# EasyEDA Pro project MAX5864_REUSE.eprj, board PCB7
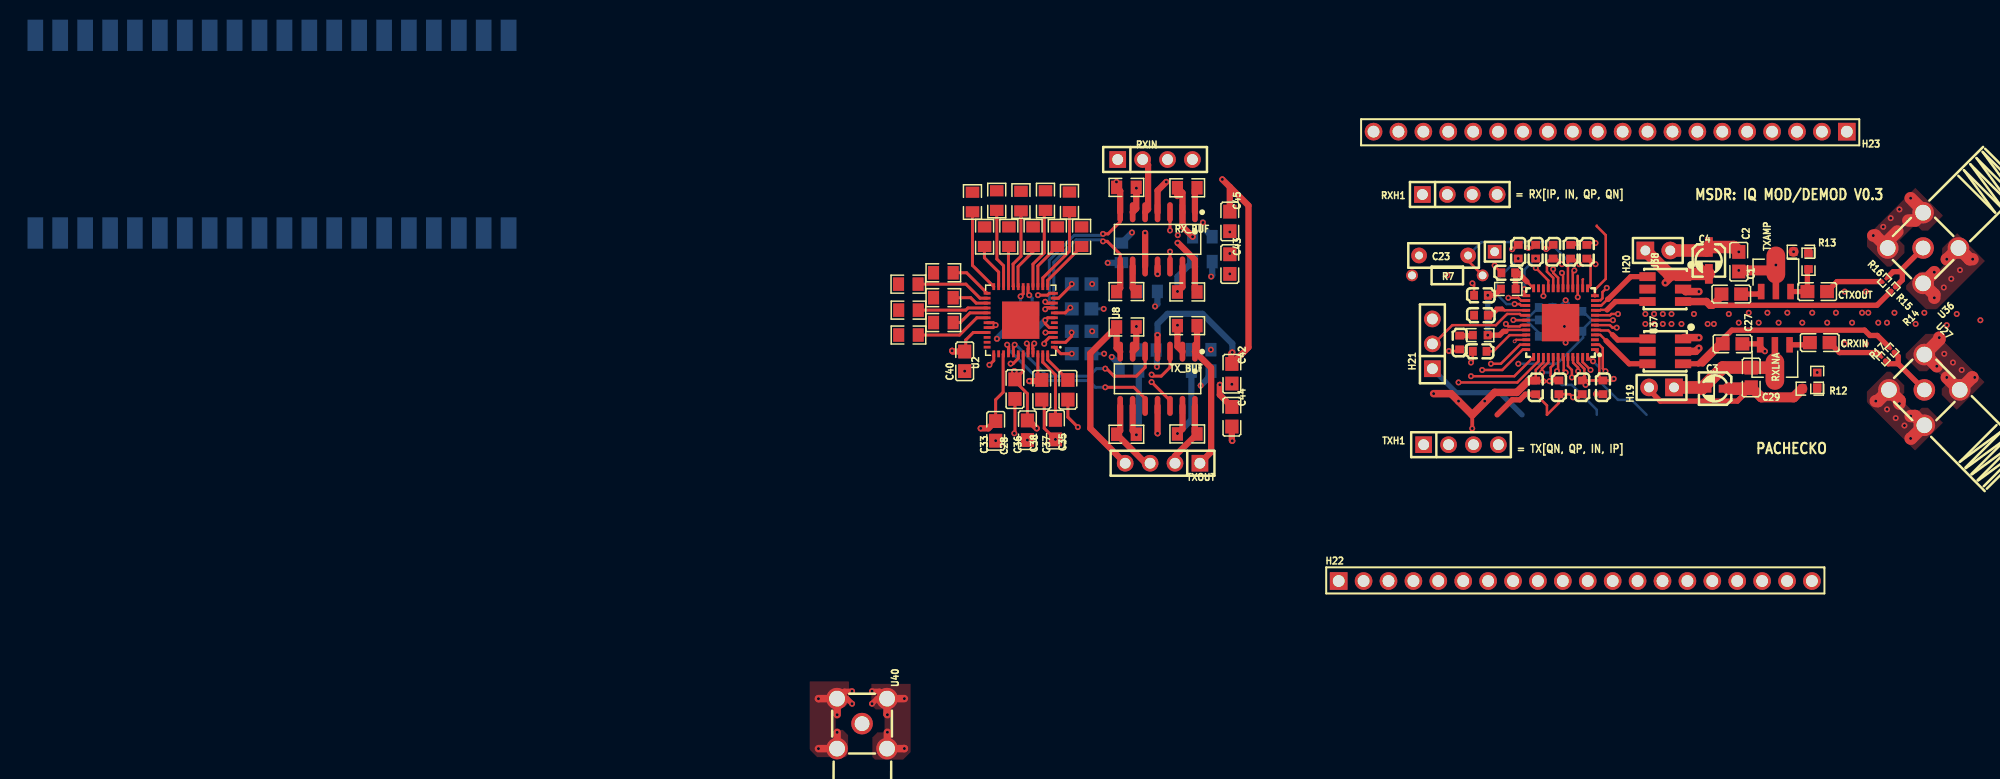
[diagram p14: board, top side]
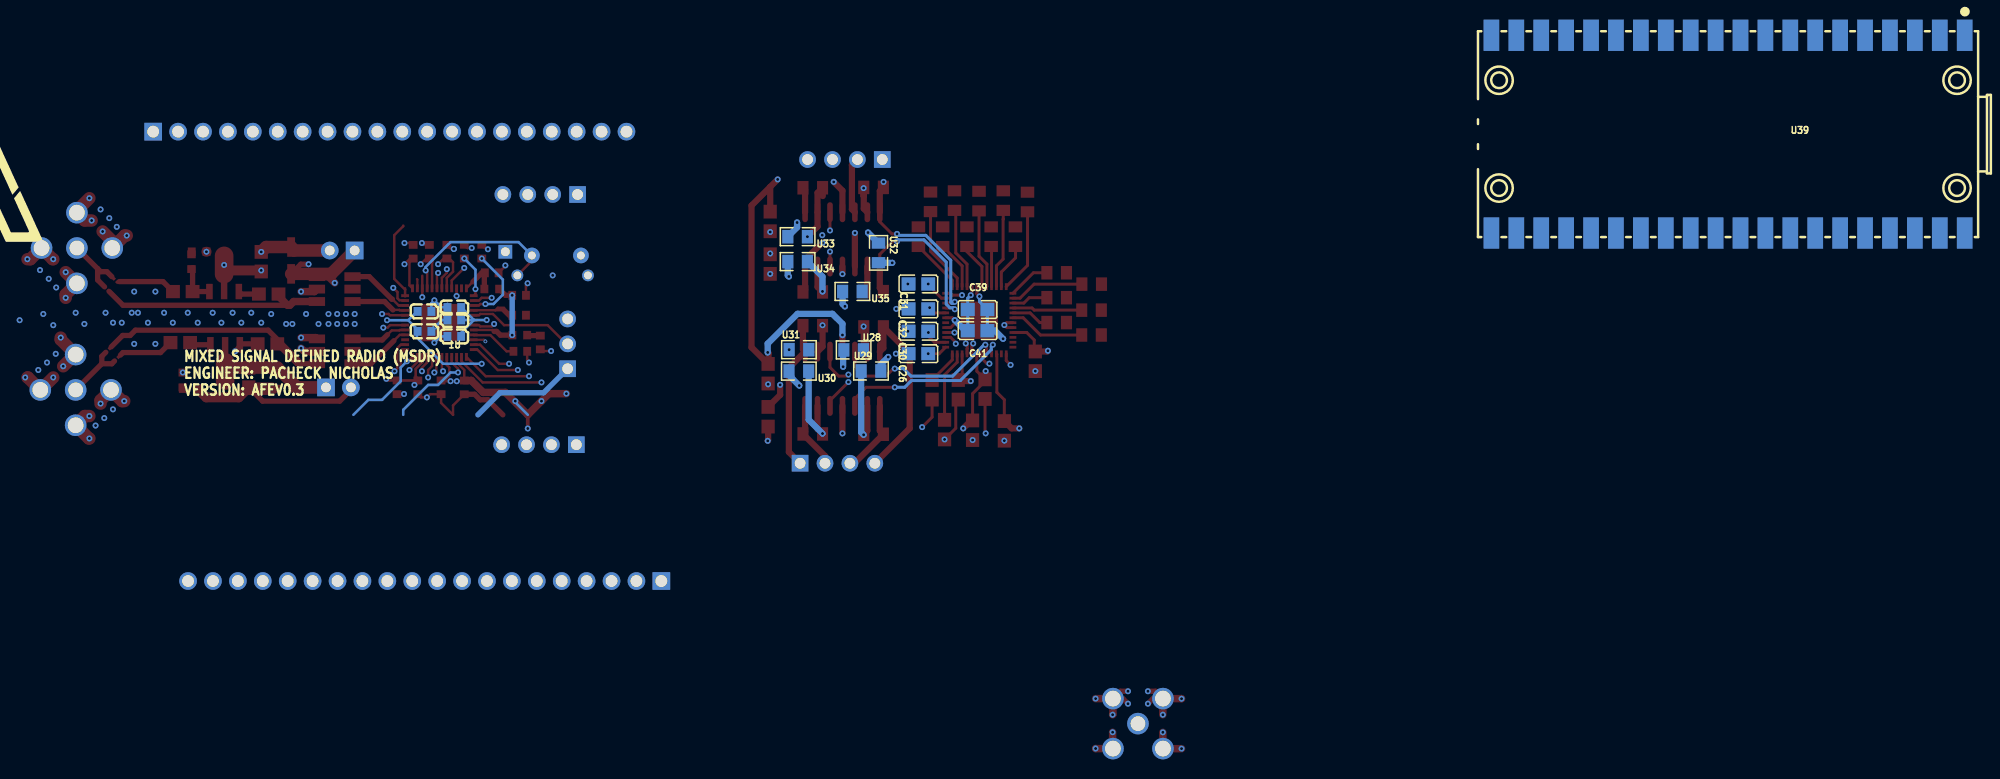
[diagram p15: board, bottom side, seen from below]

No outline. copper layers: Top Layer, Inner1, Inner2, Inner3, Inner4, Bottom Layer. Coordinates in mm from the lowest, leftmost part position.
Stack: Top Layer 0.035mm 外层铜厚1oz / Dielectric1 0.0994mm 3313 RC57% 4.2mil / Inner1 0.0152mm 内层铜厚 / Dielectric2 0.55mm 0.55mm H/H不含铜 / Inner2 0.0152mm 内层铜厚 / Dielectric3 0.1088mm 2116 RC54% 4.9mil / Inner3 0.0152mm 内层铜厚 / Dielectric4 0.55mm 0.55mm H/H不含铜 / Inner4 0.0152mm 内层铜厚 / Dielectric5 0.0994mm 3313 RC57% 4.2mil / Bottom Layer 0.035mm 外层铜厚1oz

## Design rules (mm)
template: JLCPCB Capability(Two Layers Board)
spacing copperThickness1oz (default): track to track 0.102, other pairs 0.152 to 0.3
spacing copperThickness2oz: track to track 0.203, other pairs 0.152 to 0.3
track width copperThickness1oz (default): min 0.127, default 0.254, max 2.54
track width copperThickness2oz: min 0.203, default 0.254, max 2.54
differential pair differentialPair (default): width min 0.127, default 0.254, max 2.54; gap min 0.152, default 0.152
via viaSize (default): diameter min 0.5, default 0.61, max 10; hole min 0.3, default 0.305, max 6.3

## Placement (name value [footprint] x y rotation side)
C1  22nF  [C0805]  148.49 43.83 0 top
C2  100nF  [C0805]  149.26 47.13 270 top
C3  100uF  [CAP-SMD_BD3.0-L3.3-W3.3-RD]  146.84 34.17 0 top
C4  100uF  [CAP-SMD_BD3.0-L3.3-W3.3-RD]  146.21 47.26 90 top
C18  100nF  [C0603]  122.84 37.98 0 top
C19  100nF  [C0603]  122.96 41.67 0 top
C20  100pF  [C0603]  125.75 45.99 0 top
C21  2200pF  [C0603]  120.8 38.89 90 top
C22  68pF  [C0603]  122.96 43.7 0 top
C23  470nF  [CAP-TH_L7.2-W2.5-P5.00-D0.5]  119.16 47.76 0 top
C26  330nF  [C0805]  82.24 37.74 180 bottom
C27  22nF  [C0805]  148.62 38.75 0 top
C28  100nF  [C0805]  75.45 34.12 90 top
C29  100nF  [C0805]  150.53 35.32 90 top
C30  100nF  [C0805]  82.24 40.03 0 bottom
C31  100nF  [C0805]  82.24 44.86 180 bottom
C32  100nF  [C0805]  82.24 42.31 180 bottom
C33  100nF  [C0805]  73.48 29.87 270 top
C35  330nF  [C0805]  80.85 34.06 270 top
C36  100nF  [C0805]  76.72 29.93 90 top
C37  330nF  [C0805]  79.58 30 90 top
C38  100nF  [C0805]  78.18 34.06 90 top
C39  100nF  [C0805]  76.21 42.25 180 bottom
C40  100nF  [C0805]  70.32 36.97 90 top
C41  100nF  [C0805]  76.21 40.09 180 bottom
C42  330nF  [C0805]  97.57 35.7 90 top
C43  330nF  [C0805]  97.36 46.89 270 top
C44  330nF  [C0805]  97.57 31.31 270 top
C45  330nF  [C0805]  97.36 51.24 90 top
CLNA  100pF  [C0603]  135.4 34.31 270 top
CPA  100nF  [C0603]  133.76 48.14 90 top
CPA1  10uF  [C0603]  132.61 42.06 180 bottom
CPA2  10uF  [C0603]  132.61 40.03 180 bottom
CPLL  100pF  [C0603]  130.32 48.15 90 top
CRXIN  22nF  [C0805]  157.51 38.87 0 top
CRXMX  100pF  [C0603]  133.29 34.31 270 top
CTXMX  100pF  [C0603]  132.11 48.14 90 top
CTXOUT  22nF  [C0805]  157.26 44.08 0 top
CVCCCP  10nF  [C0603]  128.55 48.15 90 top
CVCO0  100pF  [C0603]  129.57 42.45 0 bottom
CVCO1  100pF  [C0603]  129.57 41.18 0 bottom
CVCO2  100pF  [C0603]  129.57 39.51 0 bottom
CVRXA  100pF  [C0603]  128.56 34.3 270 top
CVRXF  100pF  [C0603]  130.92 34.31 270 top
CVXTAL  100pF  [C0603]  126.77 48.15 90 top
H12  -  [HDR-TH_1P-V-M_XKB_X4611WV-01I-C28D40]  124.36 48.14 180 top
H19  -  [HDR-TH_2P-P2.54-V-M-1]  141.38 34.3 180 top
H20  -  [HDR-TH_2P-P2.54-V-M-1]  141 48.27 0 top
H21  -  [HDR-TH_3P-P2.54-V-M]  118.01 38.75 90 top
H22  -  [HDR-TH_20P-P2.54-V-M-1]  132.59 14.55 0 top
H23  -  [HDR-TH_20P-P2.54-V-M-1]  136.14 60.4 180 top
R5  1.2k  [R0603]  122.89 39.64 0 top
R6  750  [R0603]  125.75 44.34 180 top
R7  10kΩ  [RES-TH_BD1.8-L3.2-P7.20-D0.4]  119.54 45.73 0 top
R10  10K  [R0603]  157.26 35.06 270 top
R11  10K  [R0603]  156.37 47.13 90 top
R12  150 @ 12v  [R0603]  156.5 34.17 180 top
R13  150 @ 12v  [R0603]  155.59 48.14 180 top
R14  10K  [R0201]  164.88 38.11 135 top
R15  10K  [R0201]  165 44.33 225 top
R16  10K  [R0201]  164.12 45.22 225 top
R17  10K  [R0201]  163.99 37.22 135 top
RX_BUF  CLC4601ISO14X  [SOIC-14_L8.7-W3.9-P1.27-LS6.0-BL]  89.99 49.41 180 top
RXH1  -  [HDR-TH_4P-P2.54-V-M]  120.81 53.99 0 top
RXIN  -  [HDR-TH_4P-P2.54-V-F]  89.74 57.56 0 top
RXLNA  GALI-S66+  [SOT-89-3_L4.5-W2.5-P1.50-LS4.2-BR]  152.94 37.3 90 top
TX_BUF  CLC4601ISO14X  [SOIC-14_L8.7-W3.9-P1.27-LS6.0-BL]  89.99 35.19 180 top
TXAMP  GALI-52+  [SOT-89-3_L4.5-W2.5-P1.50-LS4.2-BR]  153.04 45.44 270 top
TXH1  -  [HDR-TH_4P-P2.54-V-M]  120.94 28.46 0 top
TXOUT  -  [HDR-TH_4P-P2.54-V-F]  90.5 26.57 180 top
U1  MAX2831ETM+T  [TQFN-48_L7.0-W7.0-P0.50-TL-EP5.6]  131.09 40.91 180 top
U2  MAX5864ETM+  [qfn-48_l7.0-w7.0-p0.50-bl-ep5.1]  76.04 41.16 90 top
U3  1120  [R0805]  86.82 29.52 0 top
U4  1120  [R0805]  93.02 54.67 0 top
U5  1120  [R0805]  93.02 44.04 180 top
U6  1120  [R0805]  86.82 44.08 0 top
U7  1120  [R0805]  86.82 54.71 180 top
U8  1120  [R0805]  86.82 40.47 180 top
U9  1120  [R0805]  93.02 40.6 0 top
U10  1120  [R0805]  93.02 29.55 180 top
U11  100  [R0805]  64.59 39.65 0 top
U12  100  [R0805]  68.15 40.92 0 top
U13  100  [R0805]  64.59 42.19 0 top
U14  100  [R0805]  68.15 43.46 0 top
U15  100  [R0805]  64.58 44.84 0 top
U16  100  [R0805]  68.15 46 0 top
U17  100  [R0805]  71.12 53.22 90 top
U18  100  [R0805]  72.35 49.68 90 top
U19  100  [R0805]  73.59 53.36 90 top
U20  100  [R0805]  74.83 49.68 90 top
U21  100  [R0805]  76.06 53.31 90 top
U22  100  [R0805]  77.3 49.68 90 top
U23  100  [R0805]  78.56 53.36 90 top
U24  100  [R0805]  79.77 49.68 90 top
U25  100  [R0805]  81.01 53.24 90 top
U26  100  [R0805]  82.24 49.68 90 top
U27  MCX5.08-H5  [SMA-TH_MCX5.08-H5]  168.18 34.05 315 top
U28  1120  [R0805]  88.85 38.12 0 bottom
U29  1120  [R0805]  87.08 35.98 180 bottom
U30  1120  [R0805]  94.44 35.97 0 bottom
U31  1120  [R0805]  94.43 38.15 180 bottom
U32  1120  [R0805]  86.31 48.03 270 bottom
U33  1120  [R0805]  94.56 49.68 0 bottom
U34  1120  [R0805]  94.56 47.14 0 bottom
U35  1120  [R0805]  88.98 44.09 0 bottom
U36  MCX5.08-H5  [SMA-TH_MCX5.08-H5]  168.05 48.53 45 top
U37  TCM2-43X+  [IND-SMD_6P-L4.1-W3.8-P1.27-TL]  141.76 37.98 270 top
U38  TCM2-43X+  [IND-SMD_6P-L4.1-W3.8-P1.27-TL]  141.76 44.33 270 top
U39  PICO  [COMM-SMD_L51.0-W21.0-P2.54_SC0916]  0 60.14 0 bottom
U40  MCX5.08-H5  [SMA-TH_MCX5.08-H5]  59.86 0 270 top

## Footprints (pads in the part's own frame, mm; a bottom-side part is the same pattern mirrored in y, then rotated)
C0603
  rect 0.8x0.9 smd: 1(-0.7,0) 2(0.7,0)
C0805
  rect 1.41x1.35 smd: 1(-1,0) 2(1,0)
CAP-SMD_BD3.0-L3.3-W3.3-RD
  rect 2x0.8 smd: 1(1.37,0) 2(-1.37,0)
CAP-TH_L7.2-W2.5-P5.00-D0.5
  round 1.6 hole 0.8: 1(-2.5,0) 2(2.5,0)
COMM-SMD_L51.0-W21.0-P2.54_SC0916
  rect 1.6x3.2 smd: 1(-24.445,-10.088) 2(-21.905,-10.088) 3(-19.365,-10.088) 4(-16.825,-10.088) 5(-14.285,-10.088) 6(-11.745,-10.088) 7(-9.205,-10.088) 8(-6.665,-10.088) 9(-4.125,-10.088) 10(-1.585,-10.088) 11(0.955,-10.088) 12(3.495,-10.088) 13(6.035,-10.088) 14(8.575,-10.088) 15(11.115,-10.088) 16(13.655,-10.088) 17(16.195,-10.088) 18(18.735,-10.088) 19(21.275,-10.088) 20(23.815,-10.088) 21(23.815,10.088) 22(21.275,10.088) 23(18.735,10.088) 24(16.195,10.088) 25(13.655,10.088) 26(11.115,10.088) 27(8.575,10.088) 28(6.035,10.088) 29(3.495,10.088) 30(0.955,10.088) 31(-1.585,10.088) 32(-4.125,10.088) 33(-6.665,10.088) 34(-9.205,10.088) 35(-11.745,10.088) 36(-14.285,10.088) 37(-16.825,10.088) 38(-19.365,10.088) 39(-21.905,10.088) 40(-24.445,10.088)
HDR-TH_1P-V-M_XKB_X4611WV-01I-C28D40
  rect 1.4x1.4 hole 0.9: 1(0,0)
HDR-TH_2P-P2.54-V-M-1
  rect 1.8x1.8 hole 1: 1(-1.27,0)
  round 1.8 hole 1: 2(1.27,0)
HDR-TH_3P-P2.54-V-M
  rect 1.7x1.7 hole 1.1: 1(-2.54,0)
  round 1.7 hole 1.1: 2(0,0) 3(2.54,0)
HDR-TH_4P-P2.54-V-F
  rect 1.7x1.7 hole 1.1: 1(-3.81,0)
  round 1.7 hole 1.1: 2(-1.27,0) 3(1.27,0) 4(3.81,0)
HDR-TH_4P-P2.54-V-M
  rect 1.7x1.7 hole 1.1: 1(-3.81,0)
  round 1.7 hole 1.1: 2(-1.27,0) 3(1.27,0) 4(3.81,0)
HDR-TH_20P-P2.54-V-M-1
  rect 1.8x1.8 hole 1.2: 1(-24.13,0)
  round 1.8 hole 1.2: 2(-21.59,0) 3(-19.05,0) 4(-16.51,0) 5(-13.97,0) 6(-11.43,0) 7(-8.89,0) 8(-6.35,0) 9(-3.81,0) 10(-1.27,0) 11(1.27,0) 12(3.81,0) 13(6.35,0) 14(8.89,0) 15(11.43,0) 16(13.97,0) 17(16.51,0) 18(19.05,0) 19(21.59,0) 20(24.13,0)
IND-SMD_6P-L4.1-W3.8-P1.27-TL
  rect 0.9x1.657 smd: 1(-1.27,1.813) 2(0,1.813) 3(1.27,1.813) 4(1.27,-1.813) 5(0,-1.813) 6(-1.27,-1.813)
qfn-48_l7.0-w7.0-p0.50-bl-ep5.1
  rect 0.28x0.7 smd: 1(-2.75,-3.428) 2(-2.25,-3.428) 3(-1.75,-3.428) 4(-1.25,-3.428) 5(-0.75,-3.428) 6(-0.25,-3.428) 7(0.25,-3.428) 8(0.75,-3.428) 9(1.25,-3.428) 10(1.75,-3.428) 11(2.25,-3.428) 12(2.75,-3.428) 25(2.75,3.428) 26(2.25,3.428) 27(1.75,3.428) 28(1.25,3.428) 29(0.75,3.428) 30(0.25,3.428) 31(-0.25,3.428) 32(-0.75,3.428) 33(-1.25,3.428) 34(-1.75,3.428) 35(-2.25,3.428) 36(-2.75,3.428)
  rect 0.7x0.28 smd: 13(3.428,-2.75) 14(3.428,-2.25) 15(3.428,-1.75) 16(3.428,-1.25) 17(3.428,-0.75) 18(3.428,-0.25) 19(3.428,0.25) 20(3.428,0.75) 21(3.428,1.25) 22(3.428,1.75) 23(3.428,2.25) 24(3.428,2.75) 37(-3.428,2.75) 38(-3.428,2.25) 39(-3.428,1.75) 40(-3.428,1.25) 41(-3.428,0.75) 42(-3.428,0.25) 43(-3.428,-0.25) 44(-3.428,-0.75) 45(-3.428,-1.25) 46(-3.428,-1.75) 47(-3.428,-2.25) 48(-3.428,-2.75)
  rect 3.81x3.81 smd: 49(0,0)
R0201
  rect 0.303x0.324 smd: 1(-0.241,0) 2(0.241,0)
R0603
  rect 0.806x0.864 smd: 1(-0.753,0) 2(0.753,0)
R0805
  rect 1.133x1.377 smd: 1(-1,0) 2(1,0)
RES-TH_BD1.8-L3.2-P7.20-D0.4
  round 1.2 hole 0.8: 1(-3.6,0) 2(3.6,0)
SMA-TH_MCX5.08-H5
  round 2.2 hole 1.6: 1(-2.55,-2.55) 2(-2.55,2.55) 3(2.55,2.55) 4(2.55,-2.55)
  round 2.2 hole 1.5: 5(0,0)
SOIC-14_L8.7-W3.9-P1.27-LS6.0-BL
  oval 0.574x2.038 smd: 1(-3.81,-2.769) 2(-2.54,-2.769) 3(-1.27,-2.769) 4(0,-2.769) 5(1.27,-2.769) 6(2.54,-2.769) 7(3.81,-2.769) 8(3.81,2.769) 9(2.54,2.769) 10(1.27,2.769) 11(0,2.769) 12(-1.27,2.769) 13(-2.54,2.769) 14(-3.81,2.769)
SOT-89-3_L4.5-W2.5-P1.50-LS4.2-BR
  rect 1.575x0.672 smd: 1(1.356,-1.5) 3(1.356,1.5)
  custom 5.377x1.9 smd: 2(-1.356,0)
TQFN-48_L7.0-W7.0-P0.50-TL-EP5.6
  rect 0.8x0.3 smd: 1(-3.5,2.751) 2(-3.5,2.251) 3(-3.5,1.75) 4(-3.5,1.251) 5(-3.5,0.75) 6(-3.5,0.252) 7(-3.5,-0.249) 8(-3.5,-0.75) 9(-3.5,-1.25) 10(-3.5,-1.75) 11(-3.5,-2.249) 12(-3.5,-2.748) 25(3.5,-2.748) 26(3.5,-2.249) 27(3.5,-1.75) 28(3.5,-1.25) 29(3.5,-0.75) 30(3.5,-0.249) 31(3.5,0.252) 32(3.5,0.75) 33(3.5,1.251) 34(3.5,1.75) 35(3.5,2.251) 36(3.5,2.751)
  rect 0.3x0.8 smd: 13(-2.751,-3.5) 14(-2.251,-3.5) 15(-1.75,-3.5) 16(-1.25,-3.5) 17(-0.75,-3.5) 18(-0.251,-3.5) 19(0.249,-3.5) 20(0.75,-3.5) 21(1.25,-3.5) 22(1.75,-3.5) 23(2.251,-3.5) 24(2.751,-3.5) 37(2.751,3.5) 38(2.251,3.5) 39(1.75,3.5) 40(1.25,3.5) 41(0.75,3.5) 42(0.251,3.5) 43(-0.251,3.5) 44(-0.75,3.5) 45(-1.25,3.5) 46(-1.75,3.5) 47(-2.251,3.5) 48(-2.751,3.5)
  rect 3.81x3.81 smd: 49(0,0.001)

## Nets
+5V: C42.2 C45.2 RX_BUF.4 TX_BUF.4
-5V: C43.2 C44.2 RX_BUF.11 TX_BUF.11
GND: C2.2 C3.2 C4.2 C18.1 C20.1 C21.1 C22.1 C23.1 C26.1 C28.1 C29.2 C30.2 C31.1 C32.1 C33.2 C35.2 C36.1 C37.1 C38.1 C39.1 C40.1 C41.1 C42.1 C43.1 C44.1 C45.1 CLNA.2 CPA.2 CPA1.2 CPA2.2 CPLL.2 CRXMX.2 CTXMX.2 CVCCCP.2 CVCO0.2 CVCO1.2 CVCO2.2 CVRXA.2 CVRXF.2 CVXTAL.2 H19.1 H20.1 H22.3 H22.6 H22.8 H22.13 H22.18 H23.3 H23.8 H23.13 H23.18 RXLNA.2 TXAMP.2 U1.2 U1.26 U1.31 U1.47 U2.5 U2.7 U2.12 U2.17 U2.31 U2.32 U2.37 U2.42 U27.1 U27.2 U27.3 U27.4 U28.2 U29.2 U30.2 U31.1 U32.2 U33.2 U34.2 U35.2 U36.1 U36.2 U36.3 U36.4 U37.1 U37.2 U38.1 U38.2 U39.3 U39.8 U39.13 U39.18 U39.23 U39.28 U39.33 U39.35 U39.38 U40.1 U40.2 U40.3 U40.4
VCC: C3.1 C28.2 C29.1 C30.1 C31.2 C32.2 C33.1 C36.2 C38.2 C39.2 C40.2 C41.2 H19.2 R12.2 U2.2 U2.8 U2.11 U2.18 U2.33 U2.39 U2.43 U2.46
VCC2: C2.1 C4.1 H20.2 R13.2
3.3: CLNA.1 CPA.1 CPA1.1 CPA2.1 CPLL.1 CRXMX.1 CTXMX.1 CVCCCP.1 CVCO0.1 CVCO1.1 CVCO2.1 CVRXA.1 CVRXF.1 CVXTAL.1 H22.5 U1.1 U1.7 U1.13 U1.17 U1.20 U1.25 U1.27 U1.30 U1.39 U1.41 U1.46 U39.36
$1I37/BBC_CLK: U2.6
$1I37/BBC_DA0: U26.2
$1I37/BBC_DA1: U25.2
$1I37/BBC_DA2: U24.2
$1I37/BBC_DA3: U23.2
$1I37/BBC_DA4: U22.2
$1I37/BBC_DA5: U21.2
$1I37/BBC_DA6: U20.2
$1I37/BBC_DA7: U19.2
$1I37/BBC_DD0: U18.2
$1I37/BBC_DD1: U17.2
$1I37/BBC_DD2: U16.1
$1I37/BBC_DD3: U15.1
$1I37/BBC_DD4: U14.1
$1I37/BBC_DD5: U13.1
$1I37/BBC_DD6: U12.1
$1I37/BBC_DD7: U11.1
$1I37/BBC_IN: TX_BUF.12 U2.44
$1I37/BBC_IP: TX_BUF.3 U2.45
$1I37/BBC_QN: TX_BUF.10 U2.40
$1I37/BBC_QP: TX_BUF.5 U2.41
$1I37/CS: U2.36
$1I37/DIN: U2.34
$1I37/RX_BBCIN: RX_BUF.1 U2.4 U4.2
$1I37/RX_BBCIP: RX_BUF.14 U2.3 U5.1
$1I37/RX_BBCQN: RX_BUF.8 U2.9 U6.1
$1I37/RX_BBCQP: RX_BUF.7 U2.10 U7.2
$1I37/RXIN: RX_BUF.3 RXIN.4
$1I37/RXIP: RX_BUF.12 RXIN.3
$1I37/RXQN: RX_BUF.10 RXIN.1
$1I37/RXQP: RX_BUF.5 RXIN.2
$1I37/SCLK: U2.35
$1I37/TXIN: TX_BUF.14 TXOUT.2 U10.1
$1I37/TXIP: TX_BUF.1 TXOUT.1 U9.2
$1I37/TXQN: TX_BUF.8 TXOUT.3 U3.1
$1I37/TXQP: TX_BUF.7 TXOUT.4 U8.2
$1I223/BYPASS: C18.2 U1.33
$1I223/CLK: H21.1 H22.7 U39.34
$1I223/CPOUT: C20.2 R6.1 U1.24
$1I223/CS#: H22.19 U1.15 U39.22
$1I223/CTUNE: H21.2 U1.29
$1I223/D1: U1.23
$1I223/D2: U1.11
$1I223/D3: U1.8
$1I223/D4: U1.34
$1I223/D5: U1.14
$1I223/D6: U1.3
$1I223/D7: U1.6
$1I223/DIN: H22.16 U1.19 U39.25
$1I223/PLL_LOCK: H23.14 U1.22 U39.7
$1I223/RSSI: C23.2 R7.2 U1.16
$1I223/RXHP: H22.10 U1.40 U39.31
$1I223/RXIN: RXH1.2 U1.37
$1I223/RXIP: RXH1.1 U1.38
$1I223/RXN: U1.5 U37.6
$1I223/RXP: U1.4 U37.4
$1I223/RXQN: RXH1.4 U1.35
$1I223/RXQP: RXH1.3 U1.36
$1I223/RXTX_MODE: H22.12 U1.48 U39.29
$1I223/SCLK: H22.17 U1.18 U39.24
$1I223/SHDN#: H23.11 U1.12 U39.10
$1I223/TUNE: C22.2 R5.2 R6.2 U1.32
$1I223/TXIN: TXH1.3 U1.44
$1I223/TXIP: TXH1.4 U1.45
$1I223/TXN: U1.10 U38.6
$1I223/TXP: U1.9 U38.4
$1I223/TXQN: TXH1.1 U1.42
$1I223/TXQP: TXH1.2 U1.43
$1I223/XTAL: C19.2 U1.28
$1I223/XTAL_IN: C19.1 H21.3 U40.5
$1I37/$1N3982: C37.2 U2.47
$1I37/$1N8783: RX_BUF.2 U4.1 U33.1
$1I37/$1N8787: RX_BUF.6 U7.1 U32.1
$1I37/$1N8791: RX_BUF.9 U6.2 U35.1
$1I37/$1N8799: RX_BUF.13 U5.2 U34.1
$1I37/$1N9382: TX_BUF.2 U9.1 U31.2
$1I37/$1N9385: TX_BUF.6 U8.1 U28.1
$1I37/$1N9388: TX_BUF.13 U10.2 U30.1
$1I37/$1N9391: TX_BUF.9 U3.2 U29.1
$1I37/$1N10591: U2.30 U11.2
$1I37/$1N10629: U2.29 U12.2
$1I37/$1N10667: U2.28 U13.2
$1I37/$1N10705: U2.27 U14.2
$1I37/$1N10743: U2.26 U15.2
$1I37/$1N10781: U2.25 U16.2
$1I37/$1N10830: U2.24 U17.1
$1I37/$1N10868: U2.23 U18.1
$1I37/$1N10906: U2.22 U19.1
$1I37/$1N10944: U2.21 U20.1
$1I37/$1N10982: U2.20 U21.1
$1I37/$1N11020: U2.19 U22.1
$1I37/$1N11058: U2.16 U23.1
$1I37/$1N11162: U2.15 U24.1
$1I37/$1N11200: U2.14 U25.1
$1I37/$1N11238: U2.13 U26.1
$1I37/$1N11679: C35.1 U2.48
$1I37/$1N11690: C26.2 U2.1
$1I223/$1N1511: H12.1 U1.21
$1I223/$1N2412: H23.1 U39.20
$1I223/$1N2414: H23.2 U39.19
$1I223/$1N2418: H23.4 U39.17
$1I223/$1N2420: H23.5 U39.16
$1I223/$1N2434: H23.12 U39.9
$1I223/$1N2444: H23.17 U39.4
$1I223/$1N2448: H23.19 U39.2
$1I223/$1N3367: C21.2 R5.1
$1I223/$1N4636: H22.2 U39.39
$1I223/$1N5241: H22.9 R7.1 U39.32
$1I223/$1N12697: C1.1 R15.2 U38.3
$1I223/$1N12710: C1.2 TXAMP.1
$1I223/$1N12721: CTXOUT.1 R11.1 TXAMP.3
$1I223/$1N12761: C27.1 R14.2 U37.3
$1I223/$1N12820: R10.2 R12.1
$1I223/$1N12851: R11.2 R13.1
$1I223/$1N13115: C27.2 R10.1 RXLNA.3
$1I223/$1N13128: CRXIN.1 RXLNA.1
$1I223/$1N13355: R14.1 R17.1 U27.5
$1I223/$1N13417: CRXIN.2 R17.2
$1I223/$1N13419: CTXOUT.2 R16.2
$1I223/$1N13420: R15.1 R16.1 U36.5
$1I223/$1N14592: H23.20 U39.1
$1I223/$1N14693: H22.1 U39.40
$1I223/$1N14747: H22.4 U39.37
$1I223/$1N14756: H23.9 U39.12
$1I223/$1N14761: H22.14 U39.27
$1I223/$1N14771: H23.10 U39.11
$1I223/$1N14785: H23.7 U39.14
$1I223/$1N14802: H23.6 U39.15
$1I223/$1N14812: H23.15 U39.6
$1I223/$1N14844: H23.16 U39.5
$1I223/$1N19203: H22.11 U39.30
$1I223/$1N19205: H22.15 U39.26
$1I223/$1N19207: H22.20 U39.21

Pads without a net: U1 49; U2 38 49; U37 5; U38 5

## Via types
v1: diameter 0.61, hole 0.305, Top Layer to Bottom Layer, 223 vias
v2: diameter 0.381, hole 0.229, Top Layer to Bottom Layer, 1 via

## Routing (per net, layer and track width the routed paths; a pad name or vN(x,y) marks a point on that pad's centre or on a via; arc(x,y) is an arc through that point)
+5V: length 46.7
  Top Layer w0.635: v1(97.61,37.87) 97.53,37.78 97.53,36.7 ; C45.2 97.36,54.76 ; 97.36,54.76 99.26,52.86 99.26,38.39 C42.2 ; 97.36,54.76 v1(96.6,55.52) ; v1(90.88,55.27) 89.99,54.38 RX_BUF.4 ; TX_BUF.4 v1(89.99,39.65)
  Inner2 w0.635: v1(90.88,55.27) 91.13,55.52 v1(96.6,55.52)
  Bottom Layer w0.635: v1(89.99,39.65) 89.99,40.79 91.01,41.81 94.57,41.81 97.61,38.77 v1(97.61,37.87)
-5V: length 40.3
  Top Layer w0.635: 89.99,29.62 TX_BUF.11 ; v1(97.61,28.85) 97.57,28.9 C44.2 ; v1(89.99,45.87) 89.99,46.64
  Inner2 w0.635: v1(89.99,29.62) 90.25,29.62 91.39,28.47 93.8,28.47 94.18,28.85 v1(97.61,28.85) 99.26,30.5 99.26,43.98 v1(97.36,45.89) 95.98,47.27 91.39,47.27 v1(89.99,45.87)
GND: length 169
  Top Layer w0.254: v1(134.69,33.63) 135.38,33.63 CLNA.2 ; CVRXA.2 129.7,32.46 129.7,31.51 130.92,32.73 CVRXF.2 132.04,33.61 v1(132.37,33.29) 132.96,33.29 CRXMX.2 ; v1(129.61,48.43) 129.9,48.43 CPLL.2 ; U1.31 127.06,40.66 126.92,40.52 125.76,40.52 v1(125.51,40.78) ; v1(121.95,36.84) 122.14,37.03 C18.1 ; v1(126.14,48.4) 126.31,48.4 CVXTAL.2 ; U1.26 127.06,43.16 126.78,43.45 v1(125.76,43.45) ; CVCCCP.2 128.22,48.53 v1(127.79,48.53) ; v1(119.7,38.02) 120.63,38.02 C21.1 ; v1(124.36,46.75) 124.36,46.68 C20.1 ; v1(122.09,44.93) 122.26,44.76 C22.1 ; U1.2 135.03,38.66 135.39,38.31 135.39,36.23 v1(135.67,35.95) ; v1(132.87,49.03) 132.68,48.84 CTXMX.2 ; v1(134.14,36.08) 133.34,36.89 U1.47 ; CPA.2 133.95,49.03 v1(134.65,49.03)
  Top Layer w0.305: C38.1 78.43,32.81 78.43,30.14 v1(79.58,29) ; C28.1 75.45,29.68 v1(75.39,29.62) ; C35.2 80.85,31.27 v1(81.86,30.25) ; 75.79,37.73 75.79,37.25 75.26,36.73 v1(75.01,36.73) ; U2.31 73.24,40.91 v1(73.48,40.66) 73.22,40.41 U2.32 ; U2.17 76.79,43.84 v1(76.91,43.71) ; U2.7 78.79,41.41 v1(78.54,41.16) 78.54,40.82 78.95,40.41 U2.5 ; U2.12 78.96,43.91 78.77,43.71 v1(77.8,43.71) ; 73.29,37.73 73.29,37.04 v1(72.85,36.6)
  Top Layer w0.541: v1(58.84,2.03) 58.32,2.55 57.31,2.55 58.06,3.3 v1(58.84,3.3) ; C4.2 145.22,46.87 v1(144.43,46.87) ; 124.62,31.51 126.15,33.04 126.94,33.04 127.5,33.6 CVRXA.2 ; v1(60.87,2.03) 61.39,2.55 U40.2 61.66,3.3 v1(60.87,3.3)
  Top Layer w0.635: C44.1 96.34,33.54 v1(96.34,34.57)
  Top Layer w0.762: v1(55.41,-2.55) 57.31,-2.55 57.32,-2.54 v1(57.32,-0.89) ; v1(64.18,2.55) 62.41,2.55 U40.2 62.41,0.94 v1(62.44,0.91) ; v1(64.18,-2.54) 64.17,-2.55 U40.3 62.44,-2.52 v1(62.44,-0.88) ; v1(145.19,44.08) 143.83,44.08 U38.2 ; U37.1 143.7,39.38 v1(145.19,39.38) ; U38.1 142.4,45.6 v1(141.76,44.97) ; v1(55.41,2.54) 55.42,2.55 57.31,2.55 57.32,2.54 v1(57.32,0.91) ; U37.2 144.88,37.98 v1(145.19,38.3)
  Top Layer w1.016: v1(149.26,46.24) 152.48,46.24 v1(153.04,46.79)
  Top Layer w1.27: v1(169.2,46.06) 168.06,44.92 168.05,44.92 169.2,43.78 v1(169.2,43.45) ; v1(166.78,53.61) 168.05,52.34 U36.3 167.25,51.33 v1(166.55,51.33) ; H20.1 142.12,45.89 C4.2 ; v1(166.78,31.38) 167.24,31.38 U27.4 166.83,29.09 v1(166.78,29.09) ; v1(170.47,35.32) 171.73,34.05 U27.3 173.06,35.32 173.09,35.32 ; 173.09,47.38 172.8,47.38 U36.4 170.52,47.38 v1(170.47,47.38) ; v1(165.64,32.65) 165.64,32.98 U27.1 163.43,32.9 v1(163.23,32.9) ; v1(169.7,39.38) 169.7,39.18 U27.2 168.26,37.65 v1(169.45,36.46) ; v1(165.43,50.21) 164.45,49.23 U36.2 163.18,49.8 v1(162.97,49.8)
  Top Layer w1.282: H19.1 145.35,34.3 C3.2 147.63,36.33 150.51,36.33 C29.2 152.56,36.32 152.94,35.94
  Inner2 w0.254: v1(122.09,44.93) 121.29,45.73 v1(119.54,45.73)
  Bottom Layer w0.254: CVCO2.2 130.97,39.51 v1(131.6,38.87) ; CPA1.2 131.91,42.88 v1(131.6,43.19) 130.9,42.49 130.61,42.49 130.27,42.83 ; CVCO1.2 130.82,41.18 v1(131.48,40.52) 131.91,40.09 CPA2.2
  Bottom Layer w0.305: C41.1 C39.1 77.21,43.41 v1(76.91,43.71) ; v1(84.54,37.74) C26.1 ; v1(84.5,42.31) C32.1
  Bottom Layer w0.635: U32.2 86.29,47.01 v1(84.91,47.01) ; U29.2 86.08,36.65 v1(85.32,37.41) ; v1(94.62,51.12) 94.62,50.63 U33.2 ; v1(95.45,45.62) 95.56,45.73 U34.2 ; v1(78.54,41.16) 77.47,40.09 C41.1 ; v1(94.39,34.49) 95.44,35.54 U30.2 ; U35.2 89.98,42.81 v1(89.74,42.57) ; U28.2 89.92,38.05 v1(89.92,36.42)
  vias: v1(70.32,35.97) v1(73.48,28.87) v1(76.72,28.93) v1(83.32,44.86) v1(83.32,40.03) v1(95.43,38.15) v1(97.36,50.16) v1(97.36,47.96) v1(97.57,34.62) v1(139.73,41.79) v1(139.73,40.78) v1(140.62,41.79) v1(140.62,40.78) v1(141.51,41.79) v1(141.51,40.78) v1(142.4,41.79) v1(142.4,40.78) v1(143.41,40.78) v1(144.68,41.79) v1(146.08,40.78) v1(146.72,40.78) v1(148.24,41.79) v1(149.26,40.91) v1(150.27,41.92) v1(151.29,40.91) v1(152.18,41.92) v1(153.32,40.91) v1(154.21,41.92) v1(155.73,40.91) v1(156.75,41.92) v1(158.27,40.91) v1(159.16,41.92) v1(160.05,44.08) v1(160.05,38.75) v1(160.81,40.91) v1(161.83,41.92) v1(162.21,44.08) v1(162.21,38.75) v1(162.46,41.92) v1(163.48,40.91) v1(163.99,50.68) v1(164.37,40.91) v1(164.37,32.06) v1(164.75,51.57) v1(165.13,41.92) v1(165.26,31.17) v1(165.64,52.46) v1(166.15,30.41) v1(167.29,40.78) v1(168.18,41.92) v1(170.16,44.5) v1(170.21,37.73) v1(170.47,40.65) v1(170.93,45.38) v1(171.1,36.84) v1(171.48,41.79) v1(171.81,46.27) v1(171.99,36.08) v1(173.1,47.38) v1(173.32,35.32) v1(173.89,41.16)
VCC: length 61.8
  Top Layer w0.305: 78.04,35.2 77.79,35.45 77.79,37.73 ; C36.2 76.72,33.66 75.45,34.93 C28.2 76.29,35.96 76.29,37.73 ; v1(81.24,44.86) 81.24,44.75 79.9,43.41 U2.11 ; v1(81.23,39.9) 81.23,39.52 80.61,38.91 U2.2 ; v1(76.02,43.59) 76.29,43.85 U2.18 ; U2.8 80.57,41.91 v1(81.1,42.44) ; 74.29,37.73 74.24,37.69 74.24,33.81 73.48,33.04 C33.1 ; U2.33 71.2,39.91 70.43,39.14 70.43,38.08 C40.2
  Top Layer w0.541: H19.2 140.11,34.05 141.26,32.9 149.11,32.9 150.38,34.17
  Top Layer w0.635: C40.2 69.12,37.97 v1(69.04,38.04) ; v1(75.39,35.97) 75.39,35.19 C28.2 ; v1(71.96,30.12) 72.74,30.12 C33.1 ; v1(77.67,30.12) 76.86,30.93 C36.2 ; C38.2 78.04,35.2 77.78,34.95 v1(76.91,34.95)
  Top Layer w1.016: R12.2 154.85,33.29 151.56,33.29 C29.1
  Top Layer w1.282: C3.1 150.38,34.17 C29.1
  Bottom Layer w0.305: C41.2 C39.2 76.02,43.06 v1(76.02,43.59)
  Bottom Layer w0.635: v1(81.1,42.44) 81.23,42.31 C32.2 ; v1(73.61,39.27) 74.43,40.09 C41.2 ; C30.1 81.24,39.92 v1(81.23,39.9)
VCC2: length 12.9
  Top Layer w1.016: v1(154.84,48.14) R13.2
  Top Layer w1.27: H20.2 145.85,48.27 C4.1 148.76,48.63 v1(149.26,48.13)
  Inner3 w1.016: v1(154.84,48.14) 149.27,48.14 v1(149.26,48.13)
3.3: length 83.6
  Top Layer w0.254: U1.41 130.34,36.59 130.08,36.33 130.08,35.49 130.56,35.01 CVRXF.1 130.84,34.94 v1(129.95,34.94) v1(129.32,34.94) 128.62,34.94 CVRXA.1 128.56,36.08 129.32,36.84 129.32,37.4 U1.39 ; v1(134.65,46.87) 134.08,47.44 CPA.1 134.14,47.06 134.14,44.72 U1.13 ; U1.25 127.41,43.84 v1(127.41,44.33) ; CRXMX.1 133.29,34.9 v1(133.64,34.56) ; v1(131.22,46.87) 130.66,47.44 130.34,47.44 CPLL.1 130.08,47.45 129.7,47.07 129.7,46.11 130.34,45.47 U1.20 ; v1(133,46.87) 132.43,47.44 CTXMX.1 131.84,47.17 U1.17 ; v1(126.27,41.18) 126.29,41.16 U1.30 ; v1(126.4,42.81) 126.92,42.81 127.07,42.66 U1.27 ; U1.7 134.59,41.16 v1(136.43,41.16) ; U1.1 135.03,37.72 135.03,35.38 CLNA.1 136.33,35.01 v1(136.5,35.18)
  Top Layer w0.267: U1.46 132.84,36.86 133.51,36.19 133.51,35.42 133.25,35.17 133.41,35.01 CLNA.1
  Top Layer w0.381: 122.08,31.51 v1(122.08,30.11)
  Top Layer w0.762: v1(118.14,33.67) 119.92,33.67 v1(120.68,32.9) 122.08,31.51 124.36,33.79 126.62,33.79 127.84,35.01 127.85,35 CVRXA.1
  Bottom Layer w0.254: 127.56,41.18 128.87,39.87 CVCO2.1 ; 127.56,41.18 v1(126.27,41.18) ; 127.56,41.18 CVCO1.1 ; 127.56,41.18 128.87,42.49 128.87,42.58 ; v1(126.77,47.45) 124.62,45.3 124.62,43.76 125.57,42.81 v1(126.4,42.81) ; v1(128.55,47.45) 127.41,46.32 v1(127.41,44.33) ; v1(136.43,41.16) 134.27,41.16 ; 134.27,41.16 133.37,42.06 CPA1.1 ; 134.27,41.16 133.31,40.2 CPA2.1 133.38,39.95 133.38,39.38 130.71,36.71 v1(126.78,36.71) ; v1(123.35,32.9) 123.35,32.78 122.08,31.51
$1I37/BBC_IN: length 18.9
  Top Layer w0.305: v1(76.66,38.78) 76.81,38.63 76.81,38.25 76.79,38.23 76.79,37.73 ; TX_BUF.12 91.26,32.97 v1(89.38,34.85)
  Inner2 w0.305: v1(89.38,34.85) 89.23,35 80.1,35 76.81,38.29 76.81,38.63 v1(76.66,38.78)
$1I37/BBC_IP: length 18.8
  Top Layer w0.305: 77.29,37.73 77.29,38.23 77.27,38.25 77.27,38.63 v1(77.42,38.78) ; v1(89.38,35.61) 89.53,35.46 90.37,35.46 91.26,36.34 TX_BUF.3
  Inner2 w0.305: v1(77.42,38.78) 77.27,38.63 77.27,38.48 80.29,35.46 89.23,35.46 v1(89.38,35.61)
$1I37/BBC_QN: length 18.3
  Top Layer w0.305: v1(74.66,38.66) 74.81,38.5 74.81,38.25 74.79,38.23 74.79,37.73 ; 88.72,32.42 88.72,33.17 87.58,34.31 v1(84.66,34.31)
  Bottom Layer w0.305: v1(74.66,38.66) 74.81,38.5 74.81,38.16 77.97,35 82.96,35 83.64,34.31 v1(84.66,34.31)
$1I37/BBC_QP: length 18.2
  Top Layer w0.305: v1(75.42,38.66) 75.29,38.53 75.29,37.73 ; v1(84.66,36.22) 84.78,36.22 85.55,35.46 87.83,35.46 88.72,36.35 TX_BUF.5
  Bottom Layer w0.305: v1(75.42,38.66) 75.55,38.66 78.75,35.46 83.01,35.46 83.77,36.22 v1(84.66,36.22)
$1I37/RX_BBCIN: length 24.2
  Top Layer w0.305: v1(78.56,39.9) 79.46,39.9 U2.4
  Top Layer w0.635: U4.2 93.8,54.45 RX_BUF.1
  Inner2 w0.305: 92.06,49.85 v1(92.05,49.83) 91.9,49.68 89.48,49.68 81.23,41.43 80.38,41.43 78.84,39.89 78.58,39.89 v1(78.56,39.9)
  Inner2 w0.635: RX_BUF.1 93.8,51.59 92.06,49.85
$1I37/RX_BBCIP: length 25.2
  Top Layer w0.305: v1(78.43,38.76) 78.43,38.89 78.96,39.41 U2.3 ; v1(92.02,49.05) 92.04,49.06 92.06,49.06
  Top Layer w0.635: U5.1 93.8,44.26 RX_BUF.14 93.8,47.32 92.06,49.06
  Inner2 w0.305: v1(78.43,38.76) 78.78,38.76 80.99,40.97 81.42,40.97 89.67,49.22 91.85,49.22 v1(92.02,49.05)
$1I37/RX_BBCQN: length 18.7
  Top Layer w0.305: v1(84.43,49.21) 84.86,49.21 86.18,47.89 RX_BUF.8 ; U2.9 78.96,42.41 78.94,42.43 78.69,42.43 v1(78.54,42.28)
  Top Layer w0.635: RX_BUF.8 86.18,44.44 U6.1
  Bottom Layer w0.305: v1(84.43,49.21) 84.28,49.36 81.68,49.36 79.41,47.09 79.41,42.8 79.03,42.43 78.69,42.43 v1(78.54,42.28)
$1I37/RX_BBCQP: length 18.9
  Top Layer w0.305: U2.10 78.96,42.91 78.94,42.89 78.69,42.89 v1(78.54,43.04) ; v1(85.8,55.27) 85.8,54.72 U7.2 ; RX_BUF.7 86.18,51.2 84.94,49.97 v1(84.43,49.97)
  Top Layer w0.635: RX_BUF.7 86.18,54.34 U7.2
  Bottom Layer w0.305: v1(84.43,49.97) 84.28,49.81 81.49,49.81 78.95,47.27 78.95,42.99 78.84,42.89 78.69,42.89 v1(78.54,43.04)
$1I37/RXIN: length 10
  Top Layer w0.305: 91.26,50.32 RX_BUF.3
  Inner3 w0.635: v1(91.26,50.32) 93.55,52.6 RXIN.4
$1I37/RXIP: length 11.8
  Top Layer w0.305: 91.26,48.16 RX_BUF.12
  Inner3 w0.635: v1(91.26,48.16) 90.01,49.41 90.01,56.55 RXIN.3
$1I37/RXQN: length 12.1
  Top Layer w0.635: v1(88.72,50.06) 88.72,46.64
  Inner3 w0.635: v1(88.72,50.06) 86.69,52.09 86.69,56.79 RXIN.1
$1I37/RXQP: length 5.7
  Top Layer w0.635: RX_BUF.5 89.03,52.48 89.03,57 RXIN.2
$1I37/TXIN: length 6.9
  Top Layer w0.635: TXOUT.2 91.77,27.31 U10.1 93.8,29.77 TX_BUF.14
$1I37/TXIP: length 15.3
  Top Layer w0.635: U9.2 94.02,38.17 TX_BUF.1 95.45,36.3 95.45,27.71 TXOUT.1
$1I37/TXQN: length 7.7
  Top Layer w0.635: TX_BUF.8 86.18,29.89 U3.1 88.77,26.57 TXOUT.3
$1I37/TXQP: length 19.2
  Top Layer w0.635: TX_BUF.7 85.82,38.32 U8.2 83.13,37.79 83.13,30.12 TXOUT.4
$1I223/BYPASS: length 4.7
  Top Layer w0.254: C18.2 124.24,37.98 125.89,39.64 127.56,39.64 U1.33
$1I223/CLK: length 11.1
  Bottom Layer w0.541: H21.1 120.46,33.76 124.91,33.76 127.16,31.51
$1I223/CPOUT: length 4.2
  Top Layer w0.254: U1.24 127.67,45.08
  Top Layer w0.541: R6.1 126.51,45.94 C20.2 126.76,45.99 127.67,45.08
$1I223/CS#: length 2.2
  Top Layer w0.254: v1(132.84,43.5) U1.15 132.84,45.69
$1I223/CTUNE: length 10.9
  Top Layer w0.254: U1.29 127.06,41.66 126.93,41.79 125.63,41.79 124.49,40.65 120.05,40.65 118.01,38.62
$1I223/D2: length 2.1
  Top Layer w0.254: v1(135.79,44.46) 135.36,44.03 135.36,43.39 135.16,43.19 134.61,43.19 U1.11
$1I223/D3: length 2.4
  Top Layer w0.254: v1(136.94,41.79) 136.26,41.79 136.13,41.66 U1.8
$1I223/D4: length 1.3
  Top Layer w0.229: U1.34 126.56,39.16 v2(126.4,39)
$1I223/D5: length 1
  Top Layer w0.229: U1.14 133.34,45.31 133.38,45.35
$1I223/D7: length 2.3
  Top Layer w0.254: U1.6 134.6,40.65 136.12,40.65 136.38,40.4 v1(136.81,40.4)
$1I223/DIN: length 2.2
  Top Layer w0.254: U1.19 130.84,45.48 130.33,45.99 v1(130.33,46.37)
$1I223/PLL_LOCK: length 0.8
  Top Layer w0.254: U1.22 v1(129.34,43.63)
$1I223/RSSI: length 17.5
  Top Layer w0.254: U1.16 132.34,46.08 v1(132.49,46.24) ; 123.27,45.6 121.66,47.21 C23.2
  Bottom Layer w0.254: C23.2 123.02,49.12 129.95,49.12 132.49,46.59 v1(132.49,46.24)
$1I223/RXHP: length 9.5
  Top Layer w0.254: U1.40 129.84,36.85 129.19,36.21 v1(129.19,35.83)
  Bottom Layer w0.254: 134.78,31.51 134.78,32.02 132.24,34.56 131.22,34.56 129.95,35.83 v1(129.19,35.83)
$1I223/RXIN: length 27.8
  Top Layer w0.254: v1(121.95,35.44) 126.37,35.44 U1.37
  Inner3 w0.267: RXH1.2 119.54,52.72 118.27,51.45 118.27,44.97 119.94,43.3 119.94,38.73 120.29,38.38 120.29,37.11 v1(121.95,35.44)
$1I223/RXIP: length 33.8
  Top Layer w0.254: U1.38 128.84,36.97 126.68,34.81 v1(120.68,34.81)
  Inner3 w0.267: RXH1.1 117,52.84 115.73,51.57 115.73,48.91 115.05,48.23 115.05,37.06 117.31,34.81 v1(120.68,34.81)
$1I223/RXN: length 5.8
  Top Layer w0.254: U1.5 135.11,40.16 135.16,40.12 135.95,40.12 136.38,39.68
  Top Layer w0.541: 136.38,39.68 136.92,39.14 139.84,39.14 U37.6
$1I223/RXP: length 6.6
  Top Layer w0.254: 135.72,39.07 135.13,39.66 U1.4
  Top Layer w0.541: 135.72,39.07 138.08,36.71 U37.4
$1I223/RXQN: length 24.2
  Top Layer w0.254: U1.35 126.95,38.66 125,36.71 v1(123.98,36.71)
  Inner3 w0.267: RXH1.4 123.22,52.59 123.22,47.38 121.32,45.48 121.32,39.25 123.86,36.71 v1(123.98,36.71)
$1I223/RXQP: length 25
  Top Layer w0.254: U1.36 127.23,38.16 125.14,36.08 v1(123.09,36.08)
  Inner3 w0.267: RXH1.3 120.81,52.72 120.81,50.05 120.54,49.78 120.54,39.14 123.09,36.59 v1(123.09,36.08)
$1I223/RXTX_MODE: length 9.3
  Top Layer w0.254: U1.48 134.28,36.97 v1(134.4,36.97)
  Bottom Layer w0.254: v1(134.4,36.97) 135.03,36.33 135.03,34.94 136.94,33.03 138.33,33.03 139.86,31.51
$1I223/SCLK: length 1.6
  Top Layer w0.254: U1.18 131.34,45.87 v1(131.22,45.99)
$1I223/SHDN#: length 8.2
  Top Layer w0.254: 134.59,44.41 134.59,44.27 ; 134.59,44.27 U1.12 134.59,43.59 ; 134.59,44.27 135.69,45.38 135.69,49.83 134.78,50.75 134.78,50.81
$1I223/TUNE: length 9.8
  Top Layer w0.254: v1(123.66,39.64) 123.65,39.64 ; 125.51,40.02 125.65,40.16 U1.32
  Top Layer w0.541: R6.2 124.35,43.7 v1(123.66,43.7)
  Top Layer w0.543: v1(123.66,39.64) 124.87,39.64 125.25,40.02 125.51,40.02
  Bottom Layer w0.541: v1(123.66,43.7) v1(123.66,39.64)
$1I223/TXIN: length 16.5
  Top Layer w0.254: v1(132.24,35.32) 132.24,36.08 131.84,36.48 U1.44
  Inner2 w0.254: v1(132.24,35.32) 132.24,34.81 130.59,33.16 124.49,33.16 123.35,32.02 123.35,29.98 122.21,28.84
$1I223/TXIP: length 14.6
  Top Layer w0.254: U1.45 132.37,37.39 132.37,36.82 132.87,36.31 v1(132.87,35.95)
  Inner2 w0.254: v1(132.87,35.95) 132.87,34.68 130.83,32.64 126.69,32.64 125.89,31.83 125.89,29.98 124.75,28.84
$1I223/TXN: length 6.6
  Top Layer w0.254: 135.89,43.31 135.24,42.66 135.12,42.66 135.11,42.66 U1.10
  Top Layer w0.541: 135.89,43.31 135.94,43.31 138.24,45.6 U38.6
$1I223/TXP: length 5.7
  Top Layer w0.254: U1.9 135.11,42.16 135.16,42.21 135.83,42.21
  Top Layer w0.541: U38.4 136.68,43.06 135.83,42.21
$1I223/TXQN: length 19.9
  Top Layer w0.254: v1(130.71,35.95) 130.84,36.07 130.84,37.41
  Inner2 w0.254: 117.13,28.84 117.13,28.97 118.27,30.11 118.27,32.02 120.43,34.17 130.02,34.17 130.71,34.87 v1(130.71,35.95)
$1I223/TXQP: length 18.3
  Top Layer w0.254: U1.43 131.41,37.34 131.41,36.02 v1(131.6,35.83)
  Inner2 w0.254: 119.54,28.84 120.81,30.11 120.81,32.02 122.46,33.67 130.33,33.67 131.51,34.84 131.51,35.73 v1(131.6,35.83)
$1I223/XTAL: length 5.1
  Top Layer w0.254: 125.38,42.18 125.13,42.43 124.49,42.43 ; 125.38,42.18 127.58,42.18 U1.28 ; 125.38,42.18 124.49,42.18 ; C19.2 123.98,41.67
  Top Layer w0.541: 123.98,41.67 124.49,42.18
$1I37/$1N3982: length 7.3
  Top Layer w0.305: 78.29,37.73 78.29,36.87 79.58,35.58 C37.2
$1I37/$1N8783: length 6.5
  Top Layer w0.635: 92,53.83 92,54.65 U4.1 92.53,54.16 RX_BUF.2 92.53,50.71 v1(93.56,49.68)
$1I37/$1N8787: length 12.1
  Top Layer w0.635: 87.82,53.83 87.83,53.85 87.83,54.14 ; 87.82,53.83 87.83,54.14 ; 87.82,53.83 U7.1 87.86,54.66 87.83,54.14 ; 87.82,53.83 87.82,52.54 RX_BUF.6 ; 87.83,54.14 v1(87.83,54.63)
  Inner2 w0.635: U32.1 v1(87.38,50.1) 87.83,50.55 v1(87.83,54.63)
  Bottom Layer w0.635: v1(87.38,50.1) U32.1
$1I37/$1N8791: length 3
  Top Layer w0.635: RX_BUF.9 87.45,44.44 U6.2 87.82,44.27 87.86,44.32
$1I37/$1N8799: length 6.6
  Top Layer w0.635: RX_BUF.13 92.53,44.55 U5.2 92.02,44.09 v1(92.02,44.09)
  Bottom Layer w0.635: U34.1 92.02,45.6 v1(92.02,44.09)
$1I37/$1N9382: length 2.9
  Top Layer w0.635: TX_BUF.2 92.02,38.47 U9.1 92.02,40.64 v1(92.02,40.65)
$1I37/$1N9385: length 2.7
  Top Layer w0.635: TX_BUF.6 87.82,38.32 U8.1 87.83,40.49 v1(87.83,40.52)
$1I37/$1N9388: length 10.1
  Top Layer w0.635: TX_BUF.13 92.53,30.07 U10.2 92.02,29.59 v1(92.02,29.6)
  Bottom Layer w0.635: U30.1 93.44,31.01 v1(92.02,29.6)
$1I37/$1N9391: length 9.7
  Top Layer w0.635: TX_BUF.9 87.45,29.89 U3.2 87.82,29.49 v1(87.83,29.47)
  Bottom Layer w0.635: U29.1 88.08,29.72 v1(87.83,29.47)
$1I37/$1N10591: length 7.7
  Top Layer w0.305: U11.2 69.8,39.65 71.56,41.41 U2.30
$1I37/$1N10629: length 3.9
  Top Layer w0.305: U12.2 69.87,40.92 70.85,41.91 U2.29
$1I37/$1N10667: length 7.1
  Top Layer w0.305: U2.28 70.65,42.41 70.43,42.19 U13.2
$1I37/$1N10705: length 3.7
  Top Layer w0.305: U14.2 70.94,43.46 71.49,42.91 U2.27
$1I37/$1N10743: length 7.6
  Top Layer w0.305: U15.2 70.45,44.84 71.88,43.41 U2.26
$1I37/$1N10781: length 4.3
  Top Layer w0.305: U16.2 70.52,46 U2.25
$1I37/$1N10830: length 8.5
  Top Layer w0.305: U2.24 71.12,46.75 U17.1
$1I37/$1N10868: length 4.7
  Top Layer w0.305: U2.23 73.79,46.07 72.34,47.52 72.34,48.67 U18.1
$1I37/$1N10906: length 8.1
  Top Layer w0.305: U2.22 74.29,46.72 73.61,47.4 73.61,51.46 73.59,51.48 U19.1
$1I37/$1N10944: length 4.1
  Top Layer w0.305: U2.21 74.79,48.64 U20.1
$1I37/$1N10982: length 8.1
  Top Layer w0.305: U21.1 76.06,47.69 75.26,46.89 75.26,44.61 U2.20
$1I37/$1N11020: length 4.7
  Top Layer w0.305: U22.1 77.3,48.17 75.77,46.63 75.77,44.6 U2.19
$1I37/$1N11058: length 8.2
  Top Layer w0.305: U2.16 77.29,46.88 78.43,48.03 78.43,52.21 78.54,52.31
$1I37/$1N11162: length 4.9
  Top Layer w0.305: U2.15 77.79,46.7 U24.1
$1I37/$1N11200: length 8.8
  Top Layer w0.305: U25.1 81.01,48.19 78.29,45.47 U2.14
$1I37/$1N11238: length 5.5
  Top Layer w0.305: U2.13 78.79,45.22 U26.1
$1I37/$1N11679: length 3.5
  Top Layer w0.305: C35.1 78.79,37.12 78.79,37.73
$1I37/$1N11690: length 2.1
  Top Layer w0.305: v1(81.24,37.74) 80.13,37.74 U2.1
$1I223/$1N1511: length 7.5
  Top Layer w0.254: v1(128.56,46.49) 129.84,45.21 U1.21
  Inner3 w0.254: H12.1 126.02,46.49 v1(128.56,46.49)
$1I223/$1N3367: length 1.4
  Top Layer w0.541: C21.2 122.09,39.59 R5.1
$1I223/$1N5241: length 25.9
  Inner3 w0.267: 116.17,45.5 116.17,38.56 117.38,37.35 119.04,37.35 122.05,34.35 129.4,34.35 132.24,31.51
$1I223/$1N12697: length 23.5
  Top Layer w0.541: 164.77,44.1 163.35,42.68 146.57,42.68
  Top Layer w0.762: C1.1 147.49,43.61 146.57,42.68 146.34,42.68 145.95,43.06 U38.3
$1I223/$1N12710: length 2.2
  Top Layer w0.541: C1.2 151.28,43.83 TXAMP.1
$1I223/$1N12721: length 4.2
  Top Layer w0.541: 156.26,46.52 CTXOUT.1 ; TXAMP.3 156.26,44.08
$1I223/$1N12761: length 26.7
  Top Layer w0.254: R14.2 164.55,38.44
  Top Layer w0.541: 145.12,36.71 148.55,40.14 162.08,40.14 162.62,39.6 163.39,39.6 164.55,38.44 ; 145.12,36.71 U37.3 ; 145.12,36.71 145.59,36.71 C27.1 147.62,38.76
$1I223/$1N13115: length 9
  Top Layer w0.533: RXLNA.3 151.44,38.47 v1(151.92,37.98)
  Top Layer w0.541: C27.2 151.34,38.75 RXLNA.3
  Inner2 w1.016: v1(157.26,35.83) 154.08,35.83 v1(151.92,37.98)
$1I223/$1N13128: length 2.2
  Top Layer w0.541: CRXIN.1 156.29,38.65 RXLNA.1
$1I223/$1N13355: length 6.5
  Top Layer w0.541: 165.51,36.71 165.51,37.48 165.11,37.88 ; 165.51,36.71 U27.5 ; 165.51,36.71 164.5,36.71 164.22,36.99
$1I223/$1N13417: length 5.6
  Top Layer w0.541: 163.61,37.6 163.35,37.86 159.53,37.86 CRXIN.2
$1I223/$1N13419: length 5.9
  Top Layer w0.541: 163.73,45.1 159.27,45.1 CTXOUT.2
$1I223/$1N13420: length 6.9
  Top Layer w0.541: 165.94,46.41 165.94,45.27 165.24,44.57 ; 165.94,46.41 165.64,46.11 165,46.11 164.5,45.6 ; 165.94,46.41 U36.5

## Copper pours and planes (outline as drawn; the poured copper is in the pictures)
GND on Top Layer: 166.32,50.03 174.36,50.03 174.36,42.29 166.32,42.29
GND on Top Layer: 54.52,4.3 58.52,4.3 58.52,-3.42 54.52,-3.42
GND on Top Layer: 166.27,39.76 174.31,39.76 174.31,32.02 166.27,32.02
GND on Top Layer: 60.81,4.05 64.82,4.05 64.82,-3.67 60.81,-3.67
GND on Top Layer: 162.34,54.66 170.08,54.66 170.08,46.62 162.34,46.62
GND on Top Layer: 162.32,35.91 170.07,35.91 170.07,27.87 162.32,27.87

## Text on the board
Bottom Silkscreen Layer: MIXED SIGNAL DEFINED RADIO (MSDR) / ENGINEER: PACHECK NICHOLAS / VERSION: AFEV0.3
Top Silkscreen Layer: = RX[IP, IN, QP, QN] | = TX[QN, QP, IN, IP] | MSDR: IQ MOD/DEMOD V0.3 | PACHECKO
